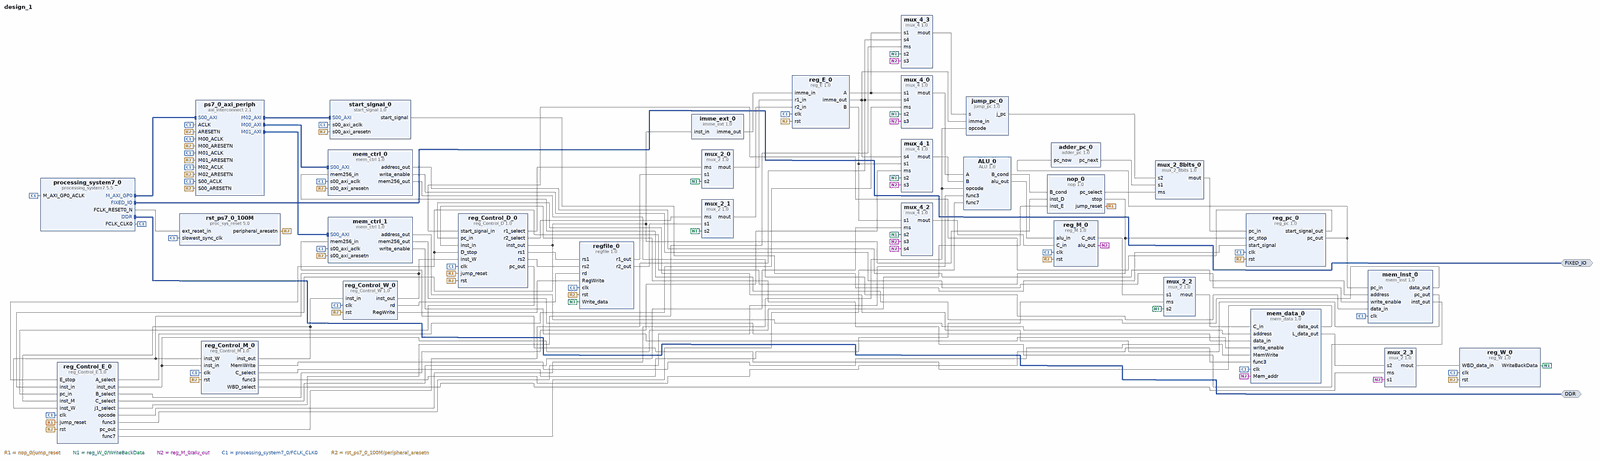
[diagram p0: block diagram of the top level, whole]
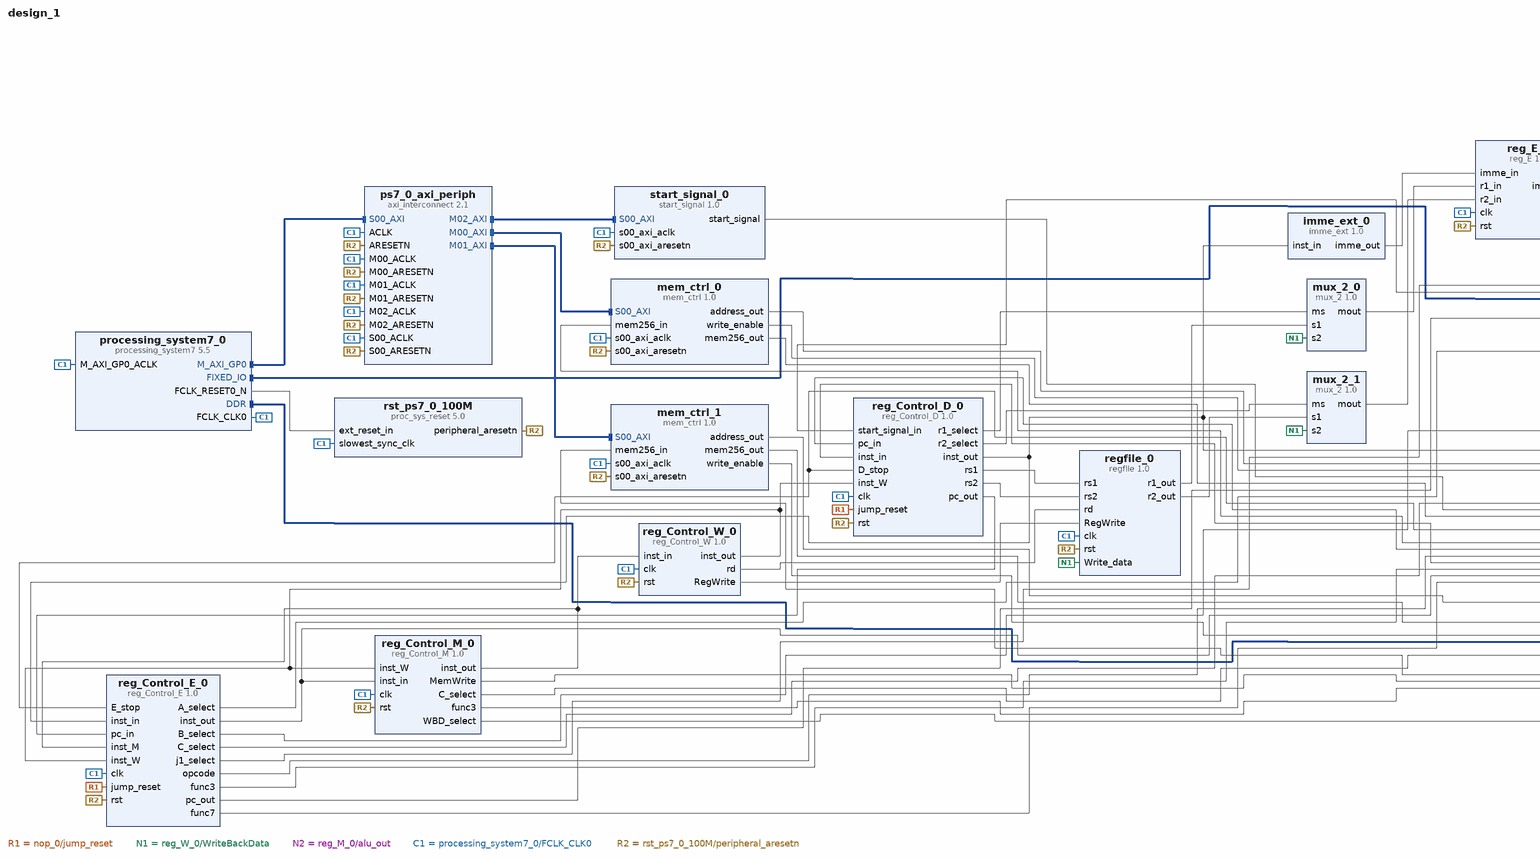
[diagram p1: block diagram of the top level, left part]
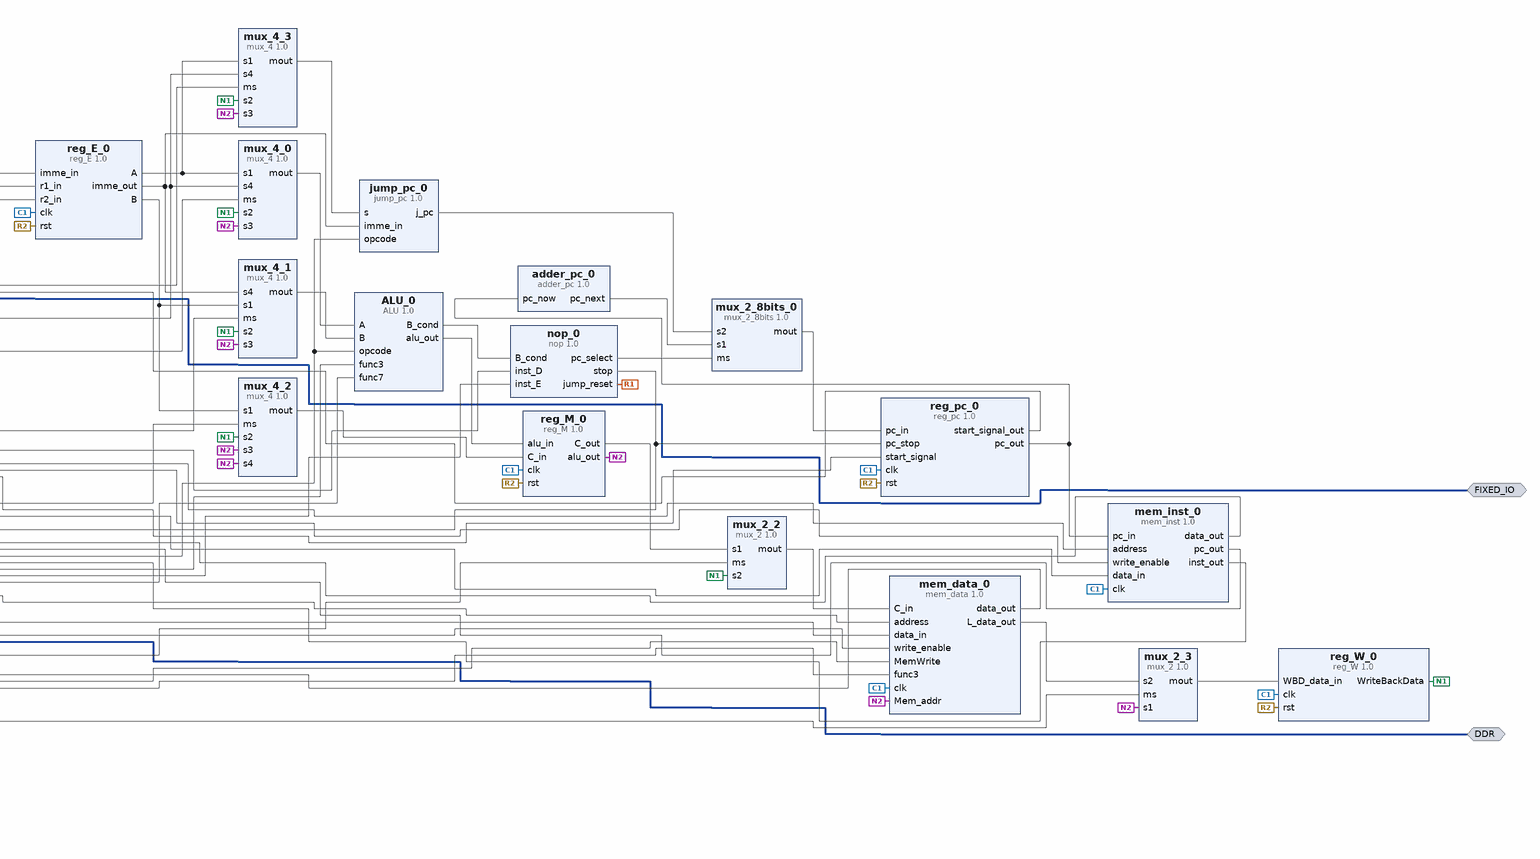
[diagram p2: block diagram of the top level, right part]
# Vivado block design design_1, xc7z020clg400-1, Vivado 2018.3
create_bd_design design_1

create_bd_intf_port -mode Master -vlnv xilinx.com:interface:ddrx_rtl:1.0 DDR
create_bd_intf_port -mode Master -vlnv xilinx.com:display_processing_system7:fixedio_rtl:1.0 FIXED_IO

create_bd_cell -type ip -vlnv xilinx.com:user:adder_pc:1.0 adder_pc_0
create_bd_cell -type ip -vlnv xilinx.com:user:ALU:1.0 ALU_0
create_bd_cell -type ip -vlnv xilinx.com:user:imme_ext:1.0 imme_ext_0
create_bd_cell -type ip -vlnv xilinx.com:user:jump_pc:1.0 jump_pc_0
create_bd_cell -type ip -vlnv xilinx.com:user:mem_data:1.0 mem_data_0
create_bd_cell -type ip -vlnv xilinx.com:user:mem_inst:1.0 mem_inst_0
create_bd_cell -type ip -vlnv xilinx.com:user:mux_2_8bits:1.0 mux_2_8bits_0
create_bd_cell -type ip -vlnv xilinx.com:user:mux_2:1.0 mux_2_0
create_bd_cell -type ip -vlnv xilinx.com:user:mux_4:1.0 mux_4_0
create_bd_cell -type ip -vlnv xilinx.com:user:nop:1.0 nop_0
create_bd_cell -type ip -vlnv xilinx.com:user:reg_Control_D:1.0 reg_Control_D_0
create_bd_cell -type ip -vlnv xilinx.com:user:reg_Control_E:1.0 reg_Control_E_0
create_bd_cell -type ip -vlnv xilinx.com:user:reg_Control_M:1.0 reg_Control_M_0
create_bd_cell -type ip -vlnv xilinx.com:user:reg_Control_W:1.0 reg_Control_W_0
create_bd_cell -type ip -vlnv xilinx.com:user:reg_E:1.0 reg_E_0
create_bd_cell -type ip -vlnv xilinx.com:user:reg_M:1.0 reg_M_0
create_bd_cell -type ip -vlnv xilinx.com:user:reg_pc:1.0 reg_pc_0
create_bd_cell -type ip -vlnv xilinx.com:user:reg_W:1.0 reg_W_0
create_bd_cell -type ip -vlnv xilinx.com:user:regfile:1.0 regfile_0
create_bd_cell -type ip -vlnv xilinx.com:user:mem_ctrl:1.0 mem_ctrl_0
create_bd_cell -type ip -vlnv xilinx.com:user:mem_ctrl:1.0 mem_ctrl_1
create_bd_cell -type ip -vlnv xilinx.com:user:mux_2:1.0 mux_2_1
create_bd_cell -type ip -vlnv xilinx.com:user:mux_2:1.0 mux_2_2
create_bd_cell -type ip -vlnv xilinx.com:user:mux_4:1.0 mux_4_1
create_bd_cell -type ip -vlnv xilinx.com:user:mux_4:1.0 mux_4_2
create_bd_cell -type ip -vlnv xilinx.com:user:mux_4:1.0 mux_4_3
create_bd_cell -type ip -vlnv xilinx.com:user:mux_2:1.0 mux_2_3
create_bd_cell -type ip -vlnv xilinx.com:ip:processing_system7:5.5 processing_system7_0
set_property -dict [list \
  CONFIG.PCW_APU_PERIPHERAL_FREQMHZ 650 \
  CONFIG.PCW_CRYSTAL_PERIPHERAL_FREQMHZ 50 \
  CONFIG.PCW_ENET0_ENET0_IO {MIO 16 .. 27} \
  CONFIG.PCW_ENET0_GRP_MDIO_ENABLE 1 \
  CONFIG.PCW_ENET0_GRP_MDIO_IO {MIO 52 .. 53} \
  CONFIG.PCW_ENET0_PERIPHERAL_ENABLE 1 \
  CONFIG.PCW_ENET0_RESET_ENABLE 1 \
  CONFIG.PCW_ENET0_RESET_IO {MIO 9} \
  CONFIG.PCW_ENET_RESET_ENABLE 1 \
  CONFIG.PCW_ENET_RESET_SELECT {Share reset pin} \
  CONFIG.PCW_FPGA0_PERIPHERAL_FREQMHZ 100 \
  CONFIG.PCW_FPGA1_PERIPHERAL_FREQMHZ 50 \
  CONFIG.PCW_GPIO_MIO_GPIO_ENABLE 1 \
  CONFIG.PCW_GPIO_MIO_GPIO_IO MIO \
  CONFIG.PCW_I2C_RESET_ENABLE 1 \
  CONFIG.PCW_M_AXI_GP0_FREQMHZ 10 \
  CONFIG.PCW_PERIPHERAL_BOARD_PRESET None \
  CONFIG.PCW_PRESET_BANK1_VOLTAGE {LVCMOS 1.8V} \
  CONFIG.PCW_QSPI_GRP_FBCLK_ENABLE 1 \
  CONFIG.PCW_QSPI_GRP_FBCLK_IO {MIO 8} \
  CONFIG.PCW_QSPI_GRP_SINGLE_SS_ENABLE 1 \
  CONFIG.PCW_QSPI_GRP_SINGLE_SS_IO {MIO 1 .. 6} \
  CONFIG.PCW_QSPI_PERIPHERAL_ENABLE 1 \
  CONFIG.PCW_QSPI_QSPI_IO {MIO 1 .. 6} \
  CONFIG.PCW_SD0_GRP_CD_ENABLE 1 \
  CONFIG.PCW_SD0_GRP_CD_IO {MIO 47} \
  CONFIG.PCW_SD0_GRP_WP_ENABLE 0 \
  CONFIG.PCW_SD0_PERIPHERAL_ENABLE 1 \
  CONFIG.PCW_SD0_SD0_IO {MIO 40 .. 45} \
  CONFIG.PCW_SDIO_PERIPHERAL_FREQMHZ 50 \
  CONFIG.PCW_SINGLE_QSPI_DATA_MODE x4 \
  CONFIG.PCW_UART0_PERIPHERAL_ENABLE 1 \
  CONFIG.PCW_UART0_UART0_IO {MIO 14 .. 15} \
  CONFIG.PCW_UART1_PERIPHERAL_ENABLE 0 \
  CONFIG.PCW_UART_PERIPHERAL_FREQMHZ 100 \
  CONFIG.PCW_UIPARAM_DDR_BUS_WIDTH {16 Bit} \
  CONFIG.PCW_UIPARAM_DDR_FREQ_MHZ 525 \
  CONFIG.PCW_UIPARAM_DDR_PARTNO {MT41J256M16 RE-125} \
  CONFIG.PCW_USB0_PERIPHERAL_ENABLE 1 \
  CONFIG.PCW_USB0_RESET_ENABLE 1 \
  CONFIG.PCW_USB0_RESET_IO {MIO 46} \
  CONFIG.PCW_USB0_USB0_IO {MIO 28 .. 39} \
  CONFIG.PCW_USB_RESET_ENABLE 1 \
  CONFIG.PCW_USB_RESET_SELECT {Share reset pin} \
] [get_bd_cells processing_system7_0]
# 481 more settings of processing_system7_0 are not shown: defaults, MIO pin electricals, DDR timing, and values the tool derives
create_bd_cell -type ip -vlnv xilinx.com:ip:axi_interconnect:2.1 ps7_0_axi_periph
set_property -dict {CONFIG.NUM_MI 3} [get_bd_cells ps7_0_axi_periph]
create_bd_cell -type ip -vlnv xilinx.com:ip:proc_sys_reset:5.0 rst_ps7_0_100M
create_bd_cell -type ip -vlnv xilinx.com:user:start_signal:1.0 start_signal_0

# ---- connections ----

connect_bd_intf_net [get_bd_intf_ports FIXED_IO] [get_bd_intf_pins processing_system7_0/FIXED_IO]
connect_bd_intf_net [get_bd_intf_pins processing_system7_0/M_AXI_GP0] [get_bd_intf_pins ps7_0_axi_periph/S00_AXI]
connect_bd_intf_net [get_bd_intf_pins ps7_0_axi_periph/M00_AXI] [get_bd_intf_pins mem_ctrl_0/S00_AXI]
connect_bd_intf_net [get_bd_intf_pins ps7_0_axi_periph/M02_AXI] [get_bd_intf_pins start_signal_0/S00_AXI]
connect_bd_intf_net [get_bd_intf_pins ps7_0_axi_periph/M01_AXI] [get_bd_intf_pins mem_ctrl_1/S00_AXI]
connect_bd_intf_net [get_bd_intf_ports DDR] [get_bd_intf_pins processing_system7_0/DDR]
connect_bd_net [get_bd_pins mux_2_8bits_0/mout] [get_bd_pins reg_pc_0/pc_in]
connect_bd_net [get_bd_pins reg_pc_0/start_signal_out] [get_bd_pins reg_Control_D_0/start_signal_in]
connect_bd_net [get_bd_pins reg_pc_0/pc_out] [get_bd_pins mem_inst_0/pc_in] [get_bd_pins adder_pc_0/pc_now]
connect_bd_net [get_bd_pins adder_pc_0/pc_next] [get_bd_pins mux_2_8bits_0/s1]
connect_bd_net [get_bd_pins nop_0/pc_select] [get_bd_pins mux_2_8bits_0/ms]
connect_bd_net [get_bd_pins nop_0/stop] [get_bd_pins reg_Control_D_0/D_stop] [get_bd_pins reg_pc_0/pc_stop] [get_bd_pins reg_Control_E_0/E_stop]
connect_bd_net [get_bd_pins nop_0/jump_reset] [get_bd_pins reg_Control_D_0/jump_reset] [get_bd_pins reg_Control_E_0/jump_reset]
connect_bd_net [get_bd_pins jump_pc_0/j_pc] [get_bd_pins mux_2_8bits_0/s2]
connect_bd_net [get_bd_pins mux_4_3/mout] [get_bd_pins jump_pc_0/s]
connect_bd_net [get_bd_pins mem_ctrl_0/address_out] [get_bd_pins mem_inst_0/address]
connect_bd_net [get_bd_pins mem_ctrl_0/write_enable] [get_bd_pins mem_inst_0/write_enable]
connect_bd_net [get_bd_pins mem_ctrl_0/mem256_out] [get_bd_pins mem_inst_0/data_in]
connect_bd_net [get_bd_pins mem_inst_0/data_out] [get_bd_pins mem_ctrl_0/mem256_in]
connect_bd_net [get_bd_pins mem_inst_0/pc_out] [get_bd_pins reg_Control_D_0/pc_in]
connect_bd_net [get_bd_pins mem_inst_0/inst_out] [get_bd_pins reg_Control_D_0/inst_in]
connect_bd_net [get_bd_pins reg_Control_W_0/inst_out] \
  [get_bd_pins reg_Control_D_0/inst_W] [get_bd_pins reg_Control_E_0/inst_W] [get_bd_pins reg_Control_M_0/inst_W]
connect_bd_net [get_bd_pins reg_Control_D_0/inst_out] \
  [get_bd_pins nop_0/inst_D] [get_bd_pins imme_ext_0/inst_in] [get_bd_pins reg_Control_E_0/inst_in]
connect_bd_net [get_bd_pins reg_Control_D_0/pc_out] [get_bd_pins reg_Control_E_0/pc_in]
connect_bd_net [get_bd_pins reg_Control_D_0/r2_select] [get_bd_pins mux_2_1/ms]
connect_bd_net [get_bd_pins reg_Control_D_0/r1_select] [get_bd_pins mux_2_0/ms]
connect_bd_net [get_bd_pins reg_Control_D_0/rs1] [get_bd_pins regfile_0/rs1]
connect_bd_net [get_bd_pins reg_Control_D_0/rs2] [get_bd_pins regfile_0/rs2]
connect_bd_net [get_bd_pins imme_ext_0/imme_out] [get_bd_pins reg_E_0/imme_in]
connect_bd_net [get_bd_pins mux_2_1/mout] [get_bd_pins reg_E_0/r2_in]
connect_bd_net [get_bd_pins mux_2_0/mout] [get_bd_pins reg_E_0/r1_in]
connect_bd_net [get_bd_pins regfile_0/r1_out] [get_bd_pins mux_2_0/s1]
connect_bd_net [get_bd_pins regfile_0/r2_out] [get_bd_pins mux_2_1/s1]
connect_bd_net [get_bd_pins reg_W_0/WriteBackData] \
  [get_bd_pins mux_2_0/s2] [get_bd_pins mux_2_1/s2] [get_bd_pins mux_4_0/s2] [get_bd_pins mux_4_1/s2] \
  [get_bd_pins mux_4_2/s2] [get_bd_pins mux_4_3/s2] [get_bd_pins mux_2_2/s2] [get_bd_pins regfile_0/Write_data]
connect_bd_net [get_bd_pins reg_Control_M_0/inst_out] [get_bd_pins reg_Control_E_0/inst_M] [get_bd_pins reg_Control_W_0/inst_in]
connect_bd_net [get_bd_pins reg_Control_E_0/inst_out] [get_bd_pins nop_0/inst_E] [get_bd_pins reg_Control_M_0/inst_in]
connect_bd_net [get_bd_pins reg_Control_E_0/A_select] [get_bd_pins mux_4_0/ms]
connect_bd_net [get_bd_pins reg_Control_E_0/B_select] [get_bd_pins mux_4_1/ms]
connect_bd_net [get_bd_pins reg_Control_E_0/C_select] [get_bd_pins mux_4_2/ms]
connect_bd_net [get_bd_pins reg_Control_E_0/j1_select] [get_bd_pins mux_4_3/ms]
connect_bd_net [get_bd_pins reg_Control_E_0/opcode] [get_bd_pins ALU_0/opcode] [get_bd_pins jump_pc_0/opcode]
connect_bd_net [get_bd_pins reg_Control_E_0/func3] [get_bd_pins ALU_0/func3]
connect_bd_net [get_bd_pins reg_Control_E_0/func7] [get_bd_pins ALU_0/func7]
connect_bd_net [get_bd_pins reg_Control_E_0/pc_out] [get_bd_pins mux_4_0/s4] [get_bd_pins mux_4_3/s4]
connect_bd_net [get_bd_pins reg_E_0/imme_out] [get_bd_pins mux_4_1/s4] [get_bd_pins jump_pc_0/imme_in]
connect_bd_net [get_bd_pins reg_E_0/B] [get_bd_pins mux_4_1/s1] [get_bd_pins mux_4_2/s1]
connect_bd_net [get_bd_pins reg_E_0/A] [get_bd_pins mux_4_0/s1] [get_bd_pins mux_4_3/s1]
connect_bd_net [get_bd_pins reg_M_0/alu_out] \
  [get_bd_pins mux_4_1/s3] [get_bd_pins mux_4_0/s3] [get_bd_pins mux_4_2/s3] [get_bd_pins mux_4_3/s3] \
  [get_bd_pins mux_4_2/s4] [get_bd_pins mux_2_3/s1] [get_bd_pins mem_data_0/Mem_addr]
connect_bd_net [get_bd_pins mux_4_0/mout] [get_bd_pins ALU_0/A]
connect_bd_net [get_bd_pins mux_4_1/mout] [get_bd_pins ALU_0/B]
connect_bd_net [get_bd_pins mux_4_2/mout] [get_bd_pins reg_M_0/C_in]
connect_bd_net [get_bd_pins ALU_0/alu_out] [get_bd_pins reg_M_0/alu_in]
connect_bd_net [get_bd_pins ALU_0/B_cond] [get_bd_pins nop_0/B_cond]
connect_bd_net [get_bd_pins mem_ctrl_1/address_out] [get_bd_pins mem_data_0/address]
connect_bd_net [get_bd_pins mem_ctrl_1/mem256_out] [get_bd_pins mem_data_0/data_in]
connect_bd_net [get_bd_pins mem_ctrl_1/write_enable] [get_bd_pins mem_data_0/write_enable]
connect_bd_net [get_bd_pins mem_data_0/data_out] [get_bd_pins mem_ctrl_1/mem256_in]
connect_bd_net [get_bd_pins mem_data_0/L_data_out] [get_bd_pins mux_2_3/s2]
connect_bd_net [get_bd_pins reg_Control_M_0/MemWrite] [get_bd_pins mem_data_0/MemWrite]
connect_bd_net [get_bd_pins reg_Control_M_0/C_select] [get_bd_pins mux_2_2/ms]
connect_bd_net [get_bd_pins reg_Control_M_0/func3] [get_bd_pins mem_data_0/func3]
connect_bd_net [get_bd_pins mux_2_2/mout] [get_bd_pins mem_data_0/C_in]
connect_bd_net [get_bd_pins reg_M_0/C_out] [get_bd_pins mux_2_2/s1]
connect_bd_net [get_bd_pins reg_Control_M_0/WBD_select] [get_bd_pins mux_2_3/ms]
connect_bd_net [get_bd_pins mux_2_3/mout] [get_bd_pins reg_W_0/WBD_data_in]
connect_bd_net [get_bd_pins reg_Control_W_0/rd] [get_bd_pins regfile_0/rd]
connect_bd_net [get_bd_pins reg_Control_W_0/RegWrite] [get_bd_pins regfile_0/RegWrite]
connect_bd_net [get_bd_pins processing_system7_0/FCLK_CLK0] \
  [get_bd_pins processing_system7_0/M_AXI_GP0_ACLK] [get_bd_pins ps7_0_axi_periph/S00_ACLK] \
  [get_bd_pins rst_ps7_0_100M/slowest_sync_clk] [get_bd_pins mem_ctrl_0/s00_axi_aclk] [get_bd_pins ps7_0_axi_periph/M00_ACLK] \
  [get_bd_pins ps7_0_axi_periph/ACLK] [get_bd_pins mem_ctrl_1/s00_axi_aclk] [get_bd_pins ps7_0_axi_periph/M01_ACLK] \
  [get_bd_pins ps7_0_axi_periph/M02_ACLK] [get_bd_pins reg_Control_D_0/clk] [get_bd_pins reg_pc_0/clk] \
  [get_bd_pins mem_inst_0/clk] [get_bd_pins regfile_0/clk] [get_bd_pins reg_E_0/clk] [get_bd_pins reg_Control_E_0/clk] \
  [get_bd_pins reg_Control_M_0/clk] [get_bd_pins reg_M_0/clk] [get_bd_pins mem_data_0/clk] [get_bd_pins reg_Control_W_0/clk] \
  [get_bd_pins reg_W_0/clk] [get_bd_pins start_signal_0/s00_axi_aclk]
connect_bd_net [get_bd_pins processing_system7_0/FCLK_RESET0_N] [get_bd_pins rst_ps7_0_100M/ext_reset_in]
connect_bd_net [get_bd_pins rst_ps7_0_100M/peripheral_aresetn] \
  [get_bd_pins ps7_0_axi_periph/S00_ARESETN] [get_bd_pins mem_ctrl_0/s00_axi_aresetn] \
  [get_bd_pins ps7_0_axi_periph/M00_ARESETN] [get_bd_pins ps7_0_axi_periph/ARESETN] [get_bd_pins mem_ctrl_1/s00_axi_aresetn] \
  [get_bd_pins ps7_0_axi_periph/M01_ARESETN] [get_bd_pins ps7_0_axi_periph/M02_ARESETN] [get_bd_pins reg_pc_0/rst] \
  [get_bd_pins reg_Control_D_0/rst] [get_bd_pins regfile_0/rst] [get_bd_pins reg_Control_E_0/rst] [get_bd_pins reg_E_0/rst] \
  [get_bd_pins reg_Control_M_0/rst] [get_bd_pins reg_M_0/rst] [get_bd_pins reg_Control_W_0/rst] [get_bd_pins reg_W_0/rst] \
  [get_bd_pins start_signal_0/s00_axi_aresetn]
connect_bd_net [get_bd_pins start_signal_0/start_signal] [get_bd_pins reg_pc_0/start_signal]

# ---- address map ----
assign_bd_address -offset 0x43C00000 -range 64K -target_address_space [get_bd_addr_spaces processing_system7_0/Data] [get_bd_addr_segs mem_ctrl_0/S00_AXI/S00_AXI_reg]
assign_bd_address -offset 0x43C10000 -range 64K -target_address_space [get_bd_addr_spaces processing_system7_0/Data] [get_bd_addr_segs mem_ctrl_1/S00_AXI/S00_AXI_reg]
assign_bd_address -offset 0x43C20000 -range 64K -target_address_space [get_bd_addr_spaces processing_system7_0/Data] [get_bd_addr_segs start_signal_0/S00_AXI/S00_AXI_reg]

validate_bd_design
save_bd_design
